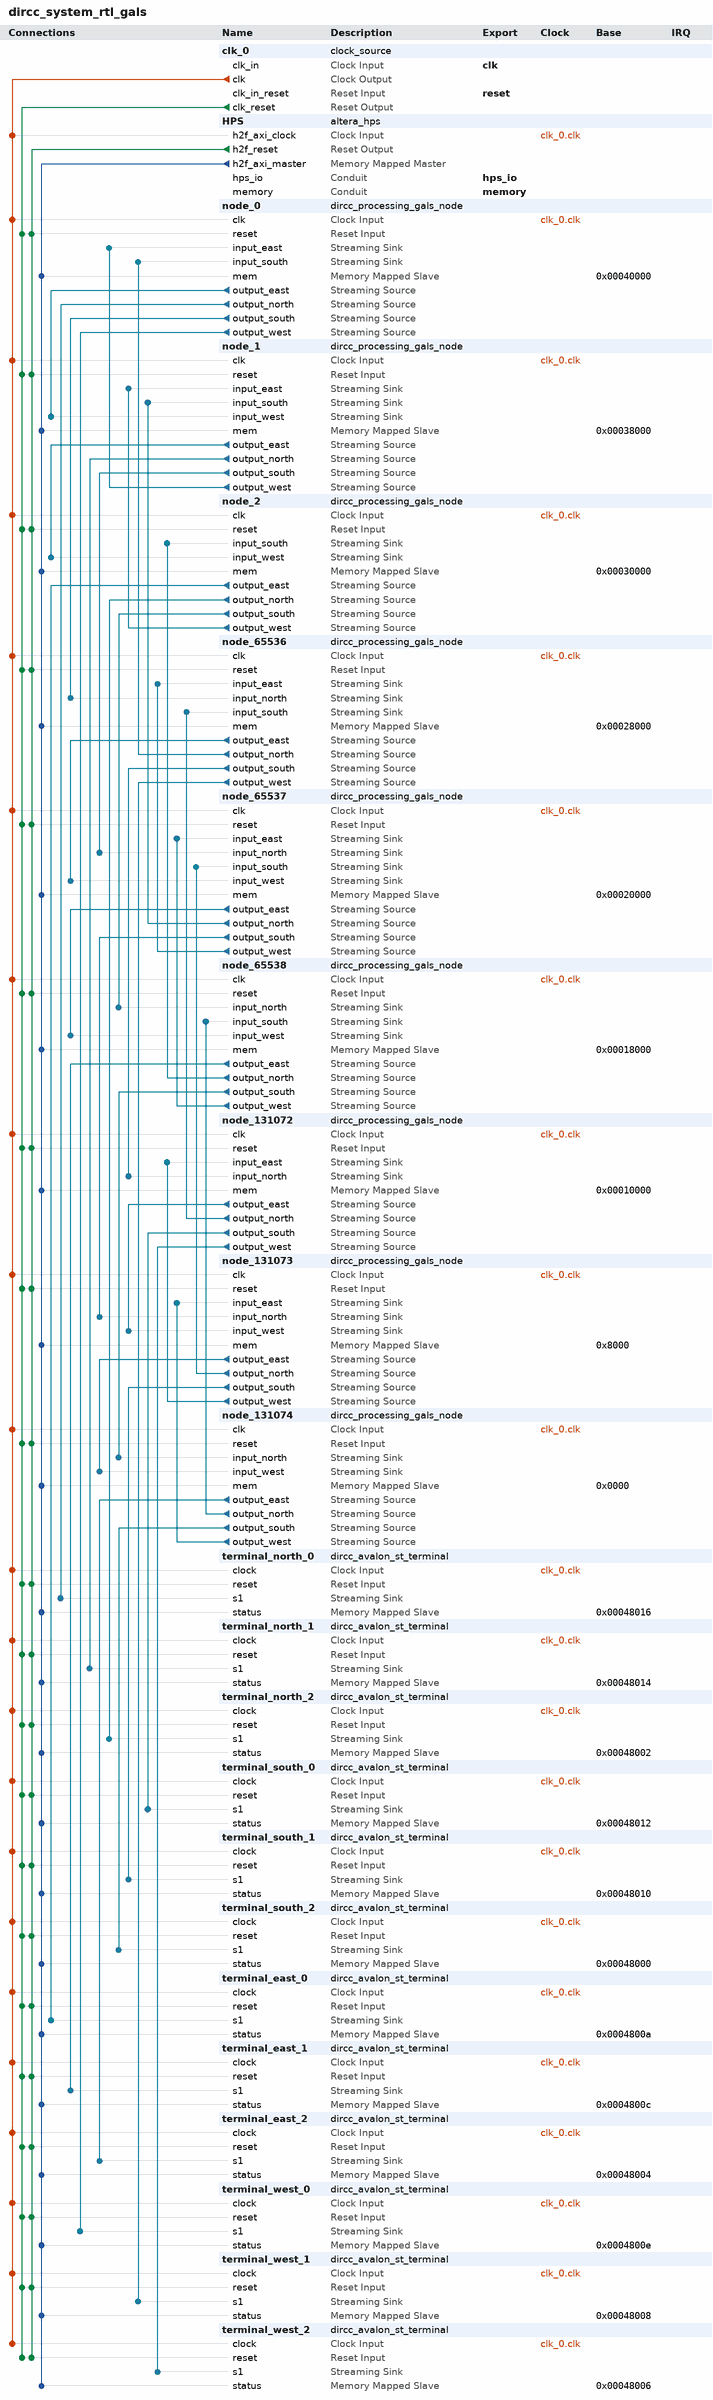
[diagram p0: system contents]
# Platform Designer (Qsys) system dircc_system_rtl_gals, Cyclone V 5CSEMA5F31C6
# Parameters at their usual value, and those the tool derives, are not listed.
package require -exact qsys 16.1
create_system dircc_system_rtl_gals
set_project_property DEVICE_FAMILY {Cyclone V}
set_project_property DEVICE 5CSEMA5F31C6

add_instance clk_0 clock_source 16.1
set_instance_parameter_value clk_0 clockFrequency 50000000

add_instance HPS altera_hps 16.1
set_instance_parameter_value HPS EMAC1_Mode N/A
set_instance_parameter_value HPS EMAC1_PinMuxing Unused
set_instance_parameter_value HPS F2SCLK_COLDRST_Enable false
set_instance_parameter_value HPS F2SCLK_DBGRST_Enable false
set_instance_parameter_value HPS F2SCLK_WARMRST_Enable false
set_instance_parameter_value HPS F2SINTERRUPT_Enable false
set_instance_parameter_value HPS F2S_Width 0
set_instance_parameter_value HPS FPGA_PERIPHERAL_OUTPUT_CLOCK_FREQ_EMAC0_GTX_CLK 125
set_instance_parameter_value HPS FPGA_PERIPHERAL_OUTPUT_CLOCK_FREQ_EMAC0_MD_CLK 2.5
set_instance_parameter_value HPS FPGA_PERIPHERAL_OUTPUT_CLOCK_FREQ_EMAC1_GTX_CLK 125
set_instance_parameter_value HPS FPGA_PERIPHERAL_OUTPUT_CLOCK_FREQ_EMAC1_MD_CLK 2.5
set_instance_parameter_value HPS HPS_PROTOCOL DDR3
set_instance_parameter_value HPS I2C0_Mode N/A
set_instance_parameter_value HPS I2C0_PinMuxing Unused
set_instance_parameter_value HPS I2C1_Mode N/A
set_instance_parameter_value HPS I2C1_PinMuxing Unused
set_instance_parameter_value HPS LWH2F_Enable false
set_instance_parameter_value HPS MEM_BANKADDR_WIDTH 3
set_instance_parameter_value HPS MEM_CLK_FREQ 400.0
set_instance_parameter_value HPS MEM_COL_ADDR_WIDTH 10
set_instance_parameter_value HPS MEM_DQ_WIDTH 32
set_instance_parameter_value HPS MEM_DRV_STR RZQ/7
set_instance_parameter_value HPS MEM_ROW_ADDR_WIDTH 15
set_instance_parameter_value HPS MEM_RTT_NOM RZQ/4
set_instance_parameter_value HPS MEM_RTT_WR RZQ/4
set_instance_parameter_value HPS MEM_TCL 11
set_instance_parameter_value HPS MEM_TFAW_NS 30.0
set_instance_parameter_value HPS MEM_TRAS_NS 35.0
set_instance_parameter_value HPS MEM_TRCD_NS 13.75
set_instance_parameter_value HPS MEM_TRFC_NS 260.0
set_instance_parameter_value HPS MEM_TRP_NS 13.75
set_instance_parameter_value HPS MEM_VENDOR Other
set_instance_parameter_value HPS MEM_WTCL 8
set_instance_parameter_value HPS QSPI_Mode N/A
set_instance_parameter_value HPS QSPI_PinMuxing Unused
set_instance_parameter_value HPS REF_CLK_FREQ 25.0
set_instance_parameter_value HPS S2FCLK_USER2CLK 5
set_instance_parameter_value HPS S2F_Width 1
set_instance_parameter_value HPS SDIO_Mode N/A
set_instance_parameter_value HPS SDIO_PinMuxing Unused
set_instance_parameter_value HPS SPIM1_Mode N/A
set_instance_parameter_value HPS SPIM1_PinMuxing Unused
set_instance_parameter_value HPS STM_Enable false
set_instance_parameter_value HPS TIMING_BOARD_AC_SKEW 0.02
set_instance_parameter_value HPS TIMING_BOARD_AC_TO_CK_SKEW 0.01
set_instance_parameter_value HPS TIMING_BOARD_DQ_TO_DQS_SKEW 0.05
set_instance_parameter_value HPS TIMING_BOARD_MAX_CK_DELAY 0.03
set_instance_parameter_value HPS TIMING_BOARD_MAX_DQS_DELAY 0.02
set_instance_parameter_value HPS TIMING_BOARD_SKEW_BETWEEN_DQS 0.06
set_instance_parameter_value HPS TIMING_BOARD_SKEW_CKDQS_DIMM_MAX 0.12
set_instance_parameter_value HPS TIMING_BOARD_SKEW_CKDQS_DIMM_MIN 0.06
set_instance_parameter_value HPS TIMING_BOARD_SKEW_WITHIN_DQS 0.01
set_instance_parameter_value HPS TIMING_TDH 65
set_instance_parameter_value HPS TIMING_TDQSCK 255
set_instance_parameter_value HPS TIMING_TDQSQ 125
set_instance_parameter_value HPS TIMING_TDS 30
set_instance_parameter_value HPS TIMING_TIH 140
set_instance_parameter_value HPS TIMING_TIS 180
set_instance_parameter_value HPS TIMING_TQSH 0.4
set_instance_parameter_value HPS UART0_Mode N/A
set_instance_parameter_value HPS UART0_PinMuxing Unused
set_instance_parameter_value HPS USB1_Mode N/A
set_instance_parameter_value HPS USB1_PinMuxing Unused
set_instance_parameter_value HPS desired_cfg_clk_mhz 100.0
set_instance_parameter_value HPS desired_qspi_clk_mhz 400.0

add_instance node_0 dircc_processing_gals_node 1.0
set_instance_parameter_value node_0 ADDRESS 0

add_instance node_1 dircc_processing_gals_node 1.0
set_instance_parameter_value node_1 ADDRESS 1

add_instance node_2 dircc_processing_gals_node 1.0
set_instance_parameter_value node_2 ADDRESS 2

add_instance node_65536 dircc_processing_gals_node 1.0
set_instance_parameter_value node_65536 ADDRESS 65536

add_instance node_65537 dircc_processing_gals_node 1.0
set_instance_parameter_value node_65537 ADDRESS 65537

add_instance node_65538 dircc_processing_gals_node 1.0
set_instance_parameter_value node_65538 ADDRESS 65538

add_instance node_131072 dircc_processing_gals_node 1.0
set_instance_parameter_value node_131072 ADDRESS 131072

add_instance node_131073 dircc_processing_gals_node 1.0
set_instance_parameter_value node_131073 ADDRESS 131073

add_instance node_131074 dircc_processing_gals_node 1.0
set_instance_parameter_value node_131074 ADDRESS 131074

add_instance terminal_north_0 dircc_avalon_st_terminal 1.0
set_instance_parameter_value terminal_north_0 DATA_WIDTH 32

add_instance terminal_north_1 dircc_avalon_st_terminal 1.0
set_instance_parameter_value terminal_north_1 DATA_WIDTH 32

add_instance terminal_north_2 dircc_avalon_st_terminal 1.0
set_instance_parameter_value terminal_north_2 DATA_WIDTH 32

add_instance terminal_south_0 dircc_avalon_st_terminal 1.0
set_instance_parameter_value terminal_south_0 DATA_WIDTH 32

add_instance terminal_south_1 dircc_avalon_st_terminal 1.0
set_instance_parameter_value terminal_south_1 DATA_WIDTH 32

add_instance terminal_south_2 dircc_avalon_st_terminal 1.0
set_instance_parameter_value terminal_south_2 DATA_WIDTH 32

add_instance terminal_east_0 dircc_avalon_st_terminal 1.0
set_instance_parameter_value terminal_east_0 DATA_WIDTH 32

add_instance terminal_east_1 dircc_avalon_st_terminal 1.0
set_instance_parameter_value terminal_east_1 DATA_WIDTH 32

add_instance terminal_east_2 dircc_avalon_st_terminal 1.0
set_instance_parameter_value terminal_east_2 DATA_WIDTH 32

add_instance terminal_west_0 dircc_avalon_st_terminal 1.0
set_instance_parameter_value terminal_west_0 DATA_WIDTH 32

add_instance terminal_west_1 dircc_avalon_st_terminal 1.0
set_instance_parameter_value terminal_west_1 DATA_WIDTH 32

add_instance terminal_west_2 dircc_avalon_st_terminal 1.0
set_instance_parameter_value terminal_west_2 DATA_WIDTH 32

# connections
add_connection clk_0.clk HPS.h2f_axi_clock clock
add_connection clk_0.clk node_0.clk clock
add_connection clk_0.clk node_1.clk clock
add_connection clk_0.clk node_2.clk clock
add_connection clk_0.clk node_65536.clk clock
add_connection clk_0.clk node_65537.clk clock
add_connection clk_0.clk node_65538.clk clock
add_connection clk_0.clk node_131072.clk clock
add_connection clk_0.clk node_131073.clk clock
add_connection clk_0.clk node_131074.clk clock
add_connection clk_0.clk terminal_east_0.clock clock
add_connection clk_0.clk terminal_east_1.clock clock
add_connection clk_0.clk terminal_east_2.clock clock
add_connection clk_0.clk terminal_north_0.clock clock
add_connection clk_0.clk terminal_north_1.clock clock
add_connection clk_0.clk terminal_north_2.clock clock
add_connection clk_0.clk terminal_south_0.clock clock
add_connection clk_0.clk terminal_south_1.clock clock
add_connection clk_0.clk terminal_south_2.clock clock
add_connection clk_0.clk terminal_west_0.clock clock
add_connection clk_0.clk terminal_west_1.clock clock
add_connection clk_0.clk terminal_west_2.clock clock
add_connection clk_0.clk_reset node_0.reset reset
add_connection clk_0.clk_reset node_1.reset reset
add_connection clk_0.clk_reset node_2.reset reset
add_connection clk_0.clk_reset node_65536.reset reset
add_connection clk_0.clk_reset node_65537.reset reset
add_connection clk_0.clk_reset node_65538.reset reset
add_connection clk_0.clk_reset node_131072.reset reset
add_connection clk_0.clk_reset node_131073.reset reset
add_connection clk_0.clk_reset node_131074.reset reset
add_connection clk_0.clk_reset terminal_east_0.reset reset
add_connection clk_0.clk_reset terminal_east_1.reset reset
add_connection clk_0.clk_reset terminal_east_2.reset reset
add_connection clk_0.clk_reset terminal_north_0.reset reset
add_connection clk_0.clk_reset terminal_north_1.reset reset
add_connection clk_0.clk_reset terminal_north_2.reset reset
add_connection clk_0.clk_reset terminal_south_0.reset reset
add_connection clk_0.clk_reset terminal_south_1.reset reset
add_connection clk_0.clk_reset terminal_south_2.reset reset
add_connection clk_0.clk_reset terminal_west_0.reset reset
add_connection clk_0.clk_reset terminal_west_1.reset reset
add_connection clk_0.clk_reset terminal_west_2.reset reset
add_connection HPS.h2f_reset node_0.reset reset
add_connection HPS.h2f_reset node_1.reset reset
add_connection HPS.h2f_reset node_2.reset reset
add_connection HPS.h2f_reset node_65536.reset reset
add_connection HPS.h2f_reset node_65537.reset reset
add_connection HPS.h2f_reset node_65538.reset reset
add_connection HPS.h2f_reset node_131072.reset reset
add_connection HPS.h2f_reset node_131073.reset reset
add_connection HPS.h2f_reset node_131074.reset reset
add_connection HPS.h2f_reset terminal_east_0.reset reset
add_connection HPS.h2f_reset terminal_east_1.reset reset
add_connection HPS.h2f_reset terminal_east_2.reset reset
add_connection HPS.h2f_reset terminal_north_0.reset reset
add_connection HPS.h2f_reset terminal_north_1.reset reset
add_connection HPS.h2f_reset terminal_north_2.reset reset
add_connection HPS.h2f_reset terminal_south_0.reset reset
add_connection HPS.h2f_reset terminal_south_1.reset reset
add_connection HPS.h2f_reset terminal_south_2.reset reset
add_connection HPS.h2f_reset terminal_west_0.reset reset
add_connection HPS.h2f_reset terminal_west_1.reset reset
add_connection HPS.h2f_reset terminal_west_2.reset reset
add_connection HPS.h2f_axi_master node_0.mem avalon
set_connection_parameter_value HPS.h2f_axi_master/node_0.mem baseAddress 0x00040000
add_connection HPS.h2f_axi_master node_1.mem avalon
set_connection_parameter_value HPS.h2f_axi_master/node_1.mem baseAddress 0x00038000
add_connection HPS.h2f_axi_master node_2.mem avalon
set_connection_parameter_value HPS.h2f_axi_master/node_2.mem baseAddress 0x00030000
add_connection HPS.h2f_axi_master node_65536.mem avalon
set_connection_parameter_value HPS.h2f_axi_master/node_65536.mem baseAddress 0x00028000
add_connection HPS.h2f_axi_master node_65537.mem avalon
set_connection_parameter_value HPS.h2f_axi_master/node_65537.mem baseAddress 0x00020000
add_connection HPS.h2f_axi_master node_65538.mem avalon
set_connection_parameter_value HPS.h2f_axi_master/node_65538.mem baseAddress 0x00018000
add_connection HPS.h2f_axi_master node_131072.mem avalon
set_connection_parameter_value HPS.h2f_axi_master/node_131072.mem baseAddress 0x00010000
add_connection HPS.h2f_axi_master node_131073.mem avalon
set_connection_parameter_value HPS.h2f_axi_master/node_131073.mem baseAddress 0x8000
add_connection HPS.h2f_axi_master node_131074.mem avalon
set_connection_parameter_value HPS.h2f_axi_master/node_131074.mem baseAddress 0x0000
add_connection HPS.h2f_axi_master terminal_east_0.status avalon
set_connection_parameter_value HPS.h2f_axi_master/terminal_east_0.status baseAddress 0x0004800a
add_connection HPS.h2f_axi_master terminal_east_1.status avalon
set_connection_parameter_value HPS.h2f_axi_master/terminal_east_1.status baseAddress 0x0004800c
add_connection HPS.h2f_axi_master terminal_east_2.status avalon
set_connection_parameter_value HPS.h2f_axi_master/terminal_east_2.status baseAddress 0x00048004
add_connection HPS.h2f_axi_master terminal_north_0.status avalon
set_connection_parameter_value HPS.h2f_axi_master/terminal_north_0.status baseAddress 0x00048016
add_connection HPS.h2f_axi_master terminal_north_1.status avalon
set_connection_parameter_value HPS.h2f_axi_master/terminal_north_1.status baseAddress 0x00048014
add_connection HPS.h2f_axi_master terminal_north_2.status avalon
set_connection_parameter_value HPS.h2f_axi_master/terminal_north_2.status baseAddress 0x00048002
add_connection HPS.h2f_axi_master terminal_south_0.status avalon
set_connection_parameter_value HPS.h2f_axi_master/terminal_south_0.status baseAddress 0x00048012
add_connection HPS.h2f_axi_master terminal_south_1.status avalon
set_connection_parameter_value HPS.h2f_axi_master/terminal_south_1.status baseAddress 0x00048010
add_connection HPS.h2f_axi_master terminal_south_2.status avalon
set_connection_parameter_value HPS.h2f_axi_master/terminal_south_2.status baseAddress 0x00048000
add_connection HPS.h2f_axi_master terminal_west_0.status avalon
set_connection_parameter_value HPS.h2f_axi_master/terminal_west_0.status baseAddress 0x0004800e
add_connection HPS.h2f_axi_master terminal_west_1.status avalon
set_connection_parameter_value HPS.h2f_axi_master/terminal_west_1.status baseAddress 0x00048008
add_connection HPS.h2f_axi_master terminal_west_2.status avalon
set_connection_parameter_value HPS.h2f_axi_master/terminal_west_2.status baseAddress 0x00048006
add_connection node_0.output_east node_1.input_west avalon_streaming
add_connection node_0.output_north terminal_north_0.s1 avalon_streaming
add_connection node_0.output_south node_65536.input_north avalon_streaming
add_connection node_0.output_west terminal_west_0.s1 avalon_streaming
add_connection node_1.output_east node_2.input_west avalon_streaming
add_connection node_1.output_north terminal_north_1.s1 avalon_streaming
add_connection node_1.output_south node_65537.input_north avalon_streaming
add_connection node_1.output_west node_0.input_east avalon_streaming
add_connection node_2.output_east terminal_east_0.s1 avalon_streaming
add_connection node_2.output_north terminal_north_2.s1 avalon_streaming
add_connection node_2.output_south node_65538.input_north avalon_streaming
add_connection node_2.output_west node_1.input_east avalon_streaming
add_connection node_65536.output_east node_65537.input_west avalon_streaming
add_connection node_65536.output_north node_0.input_south avalon_streaming
add_connection node_65536.output_south node_131072.input_north avalon_streaming
add_connection node_65536.output_west terminal_west_1.s1 avalon_streaming
add_connection node_65537.output_east node_65538.input_west avalon_streaming
add_connection node_65537.output_north node_1.input_south avalon_streaming
add_connection node_65537.output_south node_131073.input_north avalon_streaming
add_connection node_65537.output_west node_65536.input_east avalon_streaming
add_connection node_65538.output_east terminal_east_1.s1 avalon_streaming
add_connection node_65538.output_north node_2.input_south avalon_streaming
add_connection node_65538.output_south node_131074.input_north avalon_streaming
add_connection node_65538.output_west node_65537.input_east avalon_streaming
add_connection node_131072.output_east node_131073.input_west avalon_streaming
add_connection node_131072.output_north node_65536.input_south avalon_streaming
add_connection node_131072.output_south terminal_south_0.s1 avalon_streaming
add_connection node_131072.output_west terminal_west_2.s1 avalon_streaming
add_connection node_131073.output_east node_131074.input_west avalon_streaming
add_connection node_131073.output_north node_65537.input_south avalon_streaming
add_connection node_131073.output_south terminal_south_1.s1 avalon_streaming
add_connection node_131073.output_west node_131072.input_east avalon_streaming
add_connection node_131074.output_east terminal_east_2.s1 avalon_streaming
add_connection node_131074.output_north node_65538.input_south avalon_streaming
add_connection node_131074.output_south terminal_south_2.s1 avalon_streaming
add_connection node_131074.output_west node_131073.input_east avalon_streaming

# exported interfaces
add_interface clk clock sink
set_interface_property clk EXPORT_OF clk_0.clk_in
add_interface hps_io conduit end
set_interface_property hps_io EXPORT_OF HPS.hps_io
add_interface memory conduit end
set_interface_property memory EXPORT_OF HPS.memory
add_interface reset reset sink
set_interface_property reset EXPORT_OF clk_0.clk_in_reset

set_interconnect_requirement {$system} qsys_mm.clockCrossingAdapter HANDSHAKE
set_interconnect_requirement {$system} qsys_mm.enableEccProtection FALSE
set_interconnect_requirement {$system} qsys_mm.insertDefaultSlave FALSE
set_interconnect_requirement {$system} qsys_mm.maxAdditionalLatency 1

save_system dircc_system_rtl_gals.qsys
